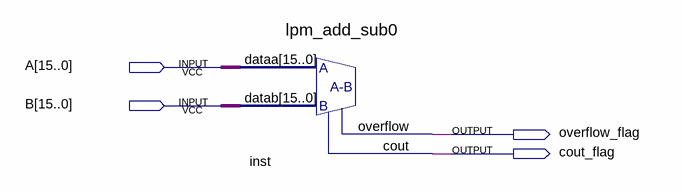
[diagram p0: schematic sheet]
// Quartus schematic CMP.bdf as structural Verilog: 1 symbols, 4 pins
module CMP (
  input  [15:0] A,
  input  [15:0] B,
  output overflow_flag,
  output cout_flag
);

  lpm_add_sub0 inst (.dataa(A), .datab(B), .overflow(overflow_flag), .cout(cout_flag));
endmodule
